# Altium schematic sheet Sheet3.SchDoc
size A4; Organization: Altium Limited; Address1: L3, 12a Rodborough Rd; Address2: Frenchs Forest; Address3: NSW; Address4: Australia 2086
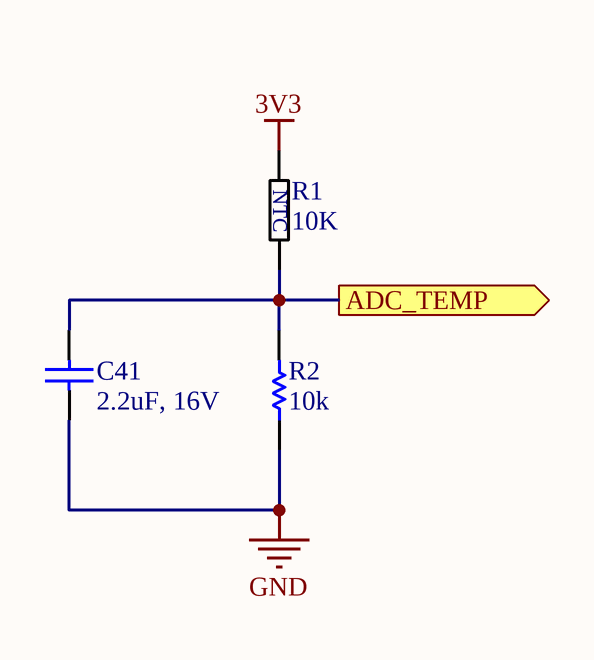
[diagram p0: Sheet3.SchDoc]

## Parts
C41  value 2.2uF, 16V  [SMD-0603 Capacitor]  (hidden comment: Voltage important)
R1  10K  [SMD-0603 Resistor]
R2  10k  [SMD-0603 Resistor]

## Ports
ADC_TEMP (out)

## Nets
3V3: R1.2
GND: C41.1 R2.1
ADC_TEMP: C41.2 R1.1 R2.2 ; port ADC_TEMP

## Notes on the sheet
- Title
- Size:
- Date:
- A4
- Number:
- Time:
- Revision:
- Sheet
- of
- File:

## Library data of the parts
C41 = 9: CAP 2.2u, 16V, 0603; Manufacturer Part Number: C1608X5R1C225M; Manufacturer: TDK Corporation; ID: 9; Place (YES/NO): YES
R1 = 15: NTC resistor (temp sensor); Manufacturer Part Number: NCP18XH103F03RB; Manufacturer: Murata Electronics North America; ID: 15; Place (YES/NO): YES; Value: 10K
R2 = 5: R 10k, 0603; Manufacturer Part Number: RK73H1JTTD1002F; Manufacturer: KOA Speer; ID: 5; Place (YES/NO): YES; Value: 10k